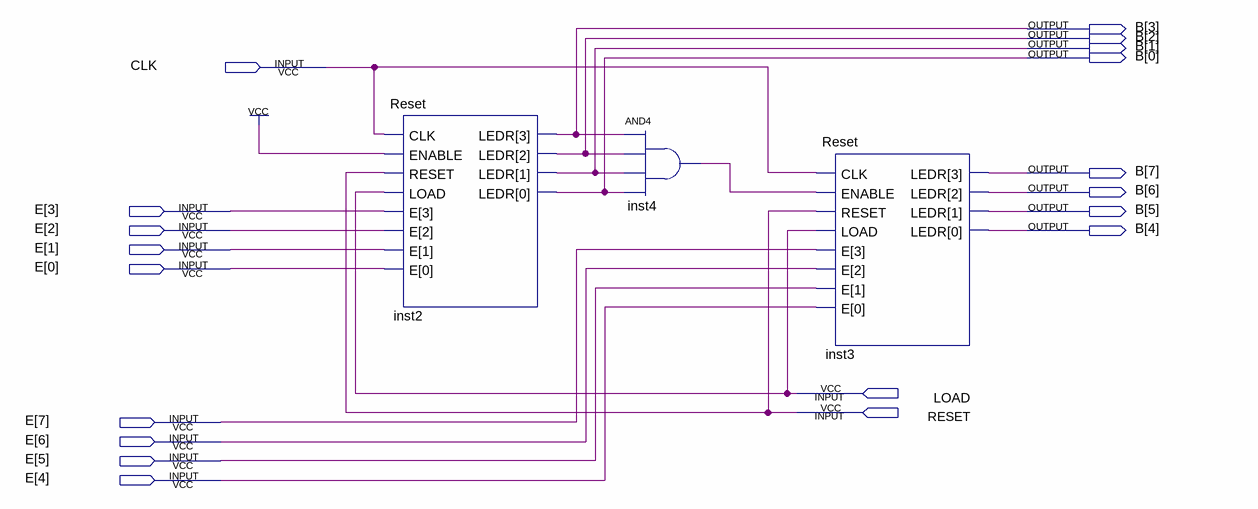
[diagram p0: schematic sheet]
// Quartus schematic Contador.bdf as structural Verilog: 3 symbols, 19 pins
module Contador (
  input  CLK,
  input  [7:0] E,
  input  LOAD,
  input  RESET,
  output [7:0] B
);

  wire inst4_out;

  Reset inst2 (.CLK(CLK), .ENABLE(1'b1), .RESET(RESET), .LOAD(LOAD), .E(E[3:0]), .LEDR(B[3:0]));
  and inst4 (inst4_out, B[3], B[2], B[1], B[0]);
  Reset inst3 (.CLK(CLK), .ENABLE(inst4_out), .RESET(RESET), .LOAD(LOAD), .E(E[7:4]), .LEDR(B[7:4]));
endmodule
